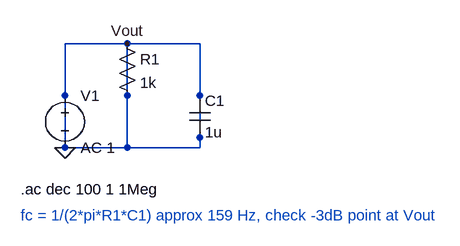
[diagram p0: schematic 03_RC_lowpass_filter.asc]
03_RC_lowpass_filter.asc, the LTspice schematic file:
Version 4
SHEET 1 880 680
WIRE 224 96 128 96
WIRE 336 96 224 96
WIRE 128 176 128 96
WIRE 224 176 224 96
WIRE 336 176 336 96
WIRE 128 256 128 176
WIRE 224 256 224 176
WIRE 224 256 128 256
WIRE 336 256 336 176
WIRE 336 256 224 256
FLAG 128 256 0
FLAG 224 96 Vout
SYMBOL voltage 128 160 R0
SYMATTR InstName V1
SYMATTR Value AC 1
SYMBOL res 208 80 R0
SYMATTR InstName R1
SYMATTR Value 1k
SYMBOL cap 320 176 R0
SYMATTR InstName C1
SYMATTR Value 1u
TEXT 60 320 Left 2 !.ac dec 100 1 1Meg
TEXT 60 360 Left 2 ;fc = 1/(2*pi*R1*C1) approx 159 Hz, check -3dB point at Vout

The netlist it stands for:
* 03_RC_lowpass_filter.asc
V1 0 0 AC 1
R1 0 0 1k
C1 0 0 1u
.ac dec 100 1 1Meg
* fc = 1/(2*pi*R1*C1) approx 159 Hz, check -3dB point at Vout
.backanno
.end